# Altium schematic sheet baro.SchDoc
size A4
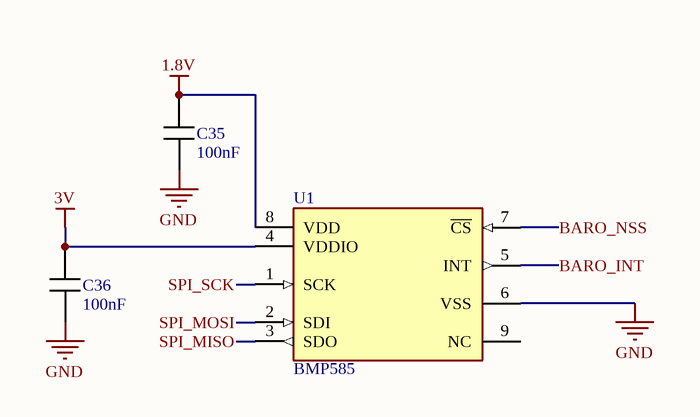
[diagram p0: baro.SchDoc]

## Parts
C35  value 100nF  [C0402]  (hidden comment: 100nF (0402) AEC-Q200)
C36  value 100nF  [C0402]  (hidden comment: 100nF (0402) AEC-Q200)
U1  BMP585  [BM585]

## Nets
1.8V: C35.2 U1.8(VDD)
3V: C36.2 U1.4(VDDIO)
GND: C35.1 C36.1 U1.6(VSS)
BARO_INT: U1.5(INT)
BARO_NSS: U1.7(~{CS})
SPI_MISO: U1.3(SDO)
SPI_MOSI: U1.2(SDI)
SPI_SCK: U1.1(SCK)

Not connected (* = marked no-connect by the designer): U1 9(NC)

## Library data of the parts
C35 C36 = 100nF (0402) AEC-Q200: X7R 0402 10% 50V AEC-Q200; Référence: GCM155R71H104KE02J; Fabricant: MURATA
U1 = BMP585: Absolute Pressure Sensor 1.65 to 3.6 V SPI -WFLGA-10; Fabricant: Bosch Sensortec; Value: BMP585; Référence: BMP585